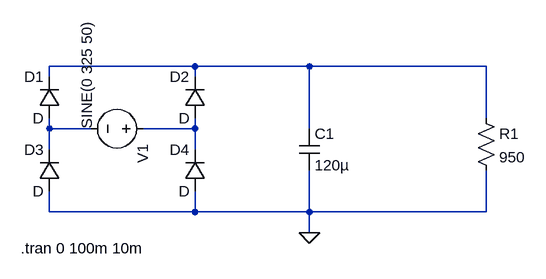
[diagram p0: schematic bulk.asc]
bulk.asc, the LTspice schematic file:
Version 4
SHEET 1 880 680
WIRE 16 32 -208 32
WIRE 192 32 16 32
WIRE 464 32 192 32
WIRE -208 48 -208 32
WIRE 16 48 16 32
WIRE 464 112 464 32
WIRE -208 128 -208 112
WIRE -144 128 -208 128
WIRE 16 128 16 112
WIRE 16 128 -64 128
WIRE 192 128 192 32
WIRE -208 160 -208 128
WIRE 16 160 16 128
WIRE -208 256 -208 224
WIRE 16 256 16 224
WIRE 16 256 -208 256
WIRE 192 256 192 192
WIRE 192 256 16 256
WIRE 464 256 464 192
WIRE 464 256 192 256
WIRE 192 288 192 256
FLAG 192 288 0
SYMBOL voltage -48 128 R90
WINDOW 3 -166 102 Left 2
WINDOW 123 0 0 Left 2
WINDOW 39 0 0 Left 2
SYMATTR InstName V1
SYMATTR Value SINE(0 325 50)
SYMBOL res 448 96 R0
SYMATTR InstName R1
SYMATTR Value 950
SYMBOL diode -192 112 R180
WINDOW 0 24 64 Left 2
WINDOW 3 24 0 Left 2
SYMATTR InstName D1
SYMBOL diode 32 112 R180
WINDOW 0 24 64 Left 2
WINDOW 3 24 0 Left 2
SYMATTR InstName D2
SYMBOL diode -192 224 R180
WINDOW 0 24 64 Left 2
WINDOW 3 24 0 Left 2
SYMATTR InstName D3
SYMBOL diode 32 224 R180
WINDOW 0 24 64 Left 2
WINDOW 3 24 0 Left 2
SYMATTR InstName D4
SYMBOL cap 176 128 R0
SYMATTR InstName C1
SYMATTR Value 120µ
TEXT -252 312 Left 2 !.tran 0 100m 10m

The netlist it stands for:
* bulk.asc
V1 N003 N002 SINE(0 325 50)
R1 N001 0 950
D1 N002 N001 D
D2 N003 N001 D
D3 0 N002 D
D4 0 N003 D
C1 N001 0 120µ
.model D D
.lib standard.dio
.tran 0 100m 10m
.backanno
.end